# Altium schematic sheet Sheet1.SchDoc
size A4; SheetNumber: 1; SheetTotal: 1
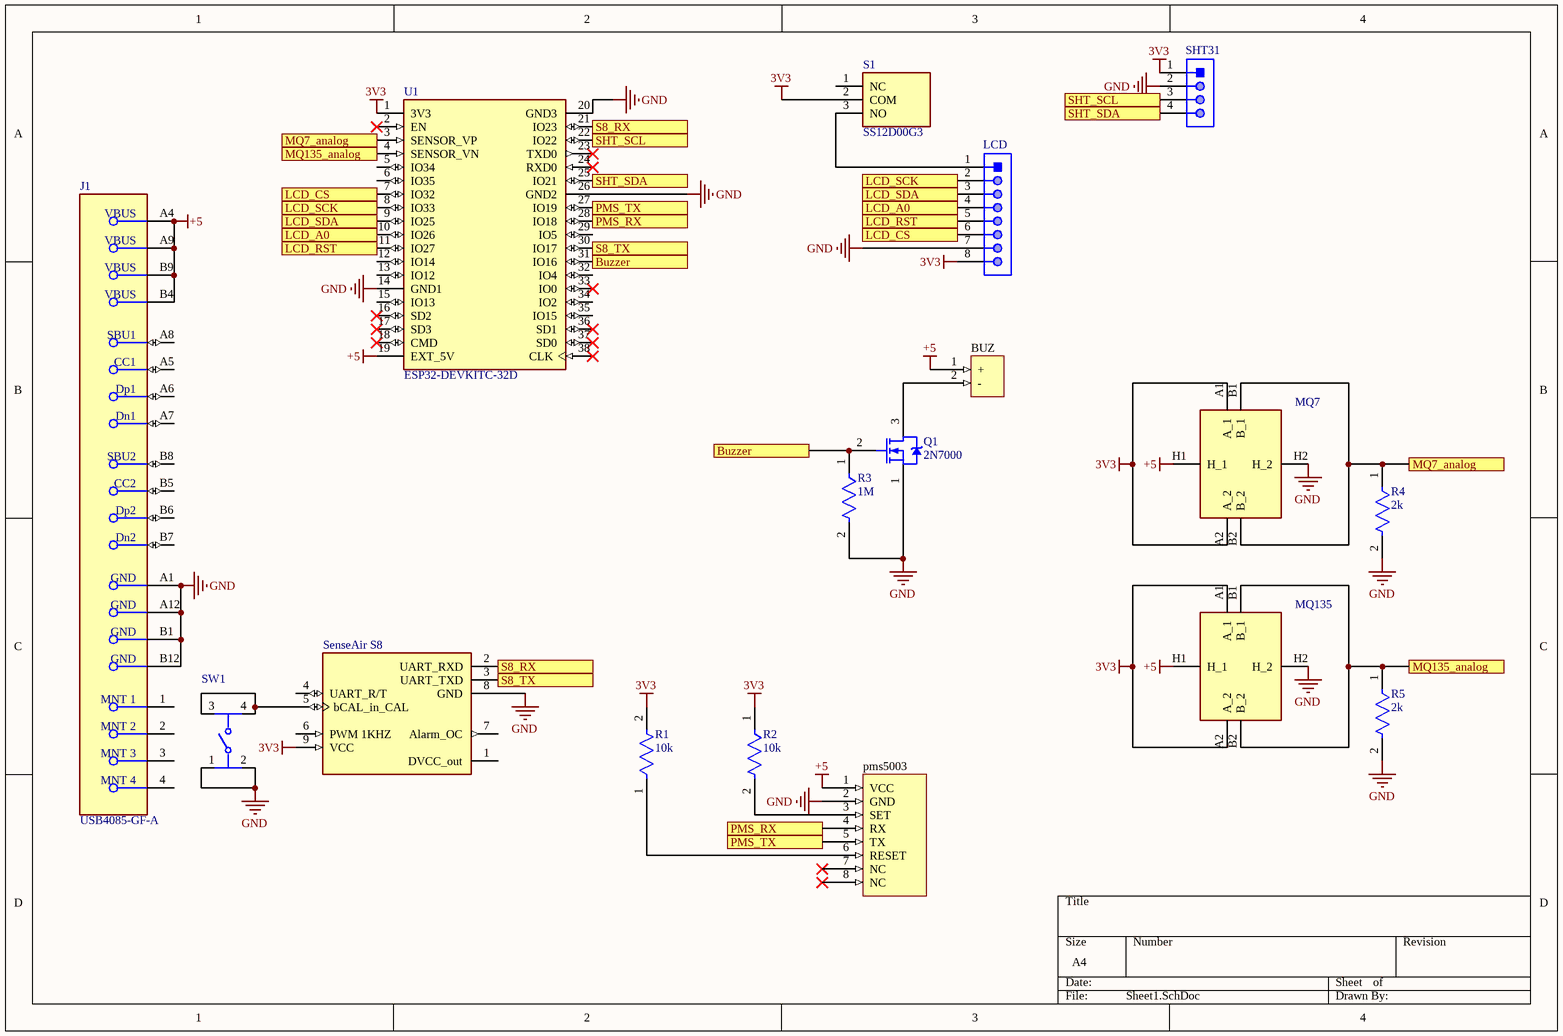
[diagram p0: Sheet1.SchDoc]

## Parts
BUZ  buzzer  [buzzer]  (value not drawn)
J1  USB4085-GF-A  [FP-USB4085-GF-A-MFG]
LCD  61300811121  [61300811121]  (value not drawn)
MQ7  POLOLU-1482  [POLOLU1482]  (value not drawn)
MQ135  POLOLU-1482  [POLOLU1482]  (value not drawn)
pms5003  pms5003  [pms5003]  (value not drawn)
Q1  2N7000  [ONSC-TO-92-3-29-11]
R1  10k  [FP-RC1206-MFG]
R2  10k  [FP-RC1206-MFG]
R3  1M  [FP-RC1206-MFG]
R4  2k  [FP-RC1206-MFG]
R5  2k  [FP-RC1206-MFG]
S1  SS12D00G3  [SS12D00G3]
SenseAir_S8  006-0-0002  [XDCR_006-0-0002]  (value not drawn)
SHT31  61300411121  [61300411121]  (value not drawn)
SW1  3-1825910-1  [FP-3-1825910-1-MFG]  (value not drawn)
U1  ESP32-DEVKITC-32D  [MODULE_ESP32-DEVKITC-32D]

## Ports
Buzzer, LCD_A0, LCD_CS, LCD_RST, LCD_SCK, LCD_SDA, MQ7_analog, MQ135_analog, PMS_RX, PMS_TX, S8_RX, S8_TX, SHT_SCL, SHT_SDA

## Nets
3V3: LCD.8 MQ7.A1(A_1) MQ7.A2(A_2) MQ135.A1(A_1) MQ135.A2(A_2) R1.2 R2.1 S1.2(COM) SenseAir_S8.9(VCC) SHT31.1 U1.1(3V3)
+5: BUZ.1(+) J1.A4(VBUS) J1.A9(VBUS) J1.B4(VBUS) J1.B9(VBUS) MQ7.H1(H_1) MQ135.H1(H_1) pms5003.1(VCC) U1.19(EXT_5V)
GND: J1.A1(GND) J1.A12(GND) J1.B1(GND) J1.B12(GND) LCD.7 MQ7.H2(H_2) MQ135.H2(H_2) pms5003.2(GND) Q1.1(S) R3.2 R4.2 R5.2 SenseAir_S8.8(GND) SHT31.2 SW1.1 SW1.2 U1.14(GND1) U1.20(GND3) U1.26(GND2)
Buzzer: Q1.2(G) R3.1 U1.31(IO16) ; port Buzzer
LCD_A0: LCD.4 U1.10(IO26) ; port LCD_A0
LCD_CS: LCD.6 U1.7(IO32) ; port LCD_CS
LCD_RST: LCD.5 U1.11(IO27) ; port LCD_RST
LCD_SCK: LCD.2 U1.8(IO33) ; port LCD_SCK
LCD_SDA: LCD.3 U1.9(IO25) ; port LCD_SDA
MQ7_analog: MQ7.B1(B_1) MQ7.B2(B_2) R4.1 U1.3(SENSOR_VP) ; port MQ7_analog
MQ135_analog: MQ135.B1(B_1) MQ135.B2(B_2) R5.1 U1.4(SENSOR_VN) ; port MQ135_analog
PMS_RX: pms5003.4(RX) U1.28(IO18) ; port PMS_RX
PMS_TX: pms5003.5(TX) U1.27(IO19) ; port PMS_TX
S8_RX: SenseAir_S8.2(UART_RXD) U1.21(IO23) ; port S8_RX
S8_TX: SenseAir_S8.3(UART_TXD) U1.30(IO17) ; port S8_TX
SHT_SCL: SHT31.3 U1.22(IO22) ; port SHT_SCL
SHT_SDA: SHT31.4 U1.25(IO21) ; port SHT_SDA
NetBUZ_2: BUZ.2(-) Q1.3(D)
NetLCD_1: LCD.1 S1.3(NO)
Netpms5003_3: pms5003.3(SET) R2.2
Netpms5003_6: pms5003.6(RESET) R1.1
NetSenseAir_S8_5: SenseAir_S8.5(bCAL_in_CAL) SW1.3 SW1.4

Not connected (* = marked no-connect by the designer): J1 1(MNT_1) 2(MNT_2) 3(MNT_3) 4(MNT_4) A5(CC1) A6(Dp1) A7(Dn1) A8(SBU1) B5(CC2) B6(Dp2) B7(Dn2) B8(SBU2); pms5003 7(NC)* 8(NC)*; S1 1(NC); SenseAir_S8 1(DVCC_out) 4(UART_R/T) 6(PWM_1KHZ) 7(Alarm_OC); U1 2(EN)* 5(IO34) 6(IO35) 12(IO14) 13(IO12) 15(IO13) 16(SD2)* 17(SD3)* 18(CMD)* 23(TXD0)* 24(RXD0)* 29(IO5) 32(IO4) 33(IO0)* 34(IO2) 35(IO15) 36(SD1)* 37(SD0)* 38(CLK)*

## Library data of the parts
J1 = CMP-196119-000001-2: CONN RCPT USB2.0 TYPE C 24POS RA; Gender: Receptacle; Number of Positions: 16; USB Standard: USB 2.0; Orientation: Right Angle; Contact Plating: Gold; Contact Material: Copper Alloy
LCD = CMP-1502-01076-1: THT Vertical Pin Header WR-PHD, Pitch 2.54 mm, Single Row, 8 pins; Manufacturer: Wurth Elektronik; Rated Current: 3A; Pin Number: 8; Working Voltage: 250VAC; Gender: Male; Contact Resistance: 20mOhm; Pitch: 2.54mm; Withstanding Voltage: 500VAC; Publisher: WurthElektronik; Operating Temperature: -40to105degC; Orientation: Vertical; Row Number: Single; Part Number: 61300811121; Package Reference: 61300811121; Mounting Technology: THT; Packaging: Bag; Manufacturer URL: http://www.we-online.de; Datasheet URL: https://katalog.we-online.de/em/datasheet/6130xx11121.pdf
MQ7 MQ135 = POLOLU-1482: Integrated Circuit; Manufacturer_Name: Pololu; Datasheet Link: https://www.pololu.com/file/0J313/MQ7.pdf; Height: 14.5mm; Manufacturer_Part_Number: POLOLU-1482
Q1 = CMP-1058-00936-1: Small Signal MOSFET, 200 mA, 60 V, N-Channel, 3-Pin TO-92, Bulk Box; Manufacturer: On Semiconductor; Ciss Typ (pF): 60; VGS(th) Max (V): 3; Crss Typ (pF): 5; Channel Polarity: N Channel; VGS Max (V): 20; Configuration: Single; PD Max (W): 0.35; Coss Typ (pF): 25; ID Max (A): 0.2; PackageVersion: Rev. AM; ComponentLink3URL: http://www.onsemi.cn/pub_link/Collateral/2N6426-D.PDF; ComponentLink2URL: http://www.onsemi.com/pub_link/Collateral/2N7000-D.PDF; DatasheetVersion: Rev. 8; Mounting Technology: Through Hole; V(BR)DSS Min (V): 60; PartNumber: 2N7000; PackageDescription: 3-Pin Transistor Outline, Body 4.825 x 3.685 mm, Pitch 1.27 mm; ComponentLink2Description: Datasheet; ComponentLink1URL: http://www.onsemi.com/; PackageReference: TO-92-3-29-11_AM_SL; Packing: Bulk Box; ComponentLink1Description: Manufacturer URL; Package Type: TO-92; ComponentLink3Description: Package Specification
R1-R5 = CMP-2100-03681-2: RES SMD 0 OHM JUMPER 1/4W 1206; Manufacturer Part Number: RC1206JR-070RL; Manufacturer: YAGEO; Voltage Rating: 200V; Temperature Coefficient: 300ppm/°C; Power Rating: 0.25W; Value: 0Ω; Tolerance: 5%; Temperature Range Low: -55°C; Category: Res; Automotive: No; Ipc Land Pattern Name: RESC310160X55; Device Class L1: Passive Components; Temperature: -55°C to +155°C; ComponentLink2URL: https://www.yageo.com/upload/media/product/productsearch/datasheet/rchip/PYu-RC_Group_51_RoHS_L_10.pdf; Lead Free: Yes; Height: 0.65mm; Footprint Url: https://www.yageo.com/upload/website/yageo_PYu-R_Mount_10_19050818_343.pdf; Package: RC1206; Digikey Description: RES SMD 0 OHM JUMPER 1/4W 1206; Temperature Range High: +155°C; Device Class L3: Chip SMD Resistors; Device Class L2: Resistors; Octopart: https://octopart.com/rc1206jr-070rl-yageo-40025601; Resistance: 0Ω; Series: RC; ComponentLink2Description: Datasheet; Composition: Thick Film; RoHS: TRUE; Mouser Description: Resistor: thick film; SMD; 1206; 0O; 0.25W; ±5%; -55÷155°C
S1 = SS12D00G3: Switch; Manufacturer_Name: Vimex; Datasheet Link: http://vimex.com/switches/techdocs/SS12D00-tech.pdf; Height: 7mm; Manufacturer_Part_Number: SS12D00G3
SenseAir_S8 = 006-0-0002: Carbon Dioxide (CO2) Sensor; MF: Senseair North America Inc.; Availability: Warning; Price: None; Package: None; DigiKey-Purchase-URL: https://snapeda.com/shop?store=DigiKey&id=4817567; Value: *; SnapEDA_Link: https://www.snapeda.com/parts/006-0-0002/Senseair%20North%20America%20Inc./view-part/4817567/?ref=snap; MP: 006-0-0002
SHT31 = CMP-1502-01064-1: THT Vertical Pin Header WR-PHD, Pitch 2.54 mm, Single Row, 4 pins; Manufacturer: Wurth Elektronik; Withstanding Voltage: 500VAC; Rated Current: 3A; Working Voltage: 250VAC; Pin Number: 4; Gender: Male; Contact Resistance: 20mOhm; Pitch: 2.54mm; Manufacturer URL: http://www.we-online.de; Operating Temperature: -40to105degC; Packaging: Bag; Mounting Technology: THT; Package Reference: 61300411121; Datasheet URL: https://katalog.we-online.de/em/datasheet/6130xx11121.pdf; Publisher: WurthElektronik; Part Number: 61300411121; Row Number: Single; Orientation: Vertical
SW1 = CMP-03407-000001-1: SWITCH TACTILE SPST-NO 0.05A 24V; Manufacturer: TE Connectivity; Operating Force: 160gf; Contact Current Rating: 50mA; Description: Switch Tactile OFF (ON) SPST Round Button PC Pins 0.05A 24VDC 100000Cycles 1.57N Thru-Hole; Contact Resistance: 100mΩ; Electromechanical Life: 100000Cycles; Device Class L1: Electromechanical; ComponentLink2URL: https://www.te.com/commerce/DocumentDelivery/DDEController?Action=srchrtrv&DocNm=1825910&DocType=Customer+Drawing&DocLang=English; Category: Switch; Device Class L2: Switches; Temperature: -35°C to +85°C; RoHS: TRUE; Mount: Through Hole; Manufacturer Part Number: 3-1825910-1; Automotive: No; Lead Free: Yes; Device Class L3: Tactile Switches; ComponentLink2Description: Datasheet; Temperature Range High: +85°C; Height: 17.3mm; Package: 0; Temperature Range Low: -35°C; Throw Configuration: SPST-NO; Digikey Description: SWITCH TACTILE SPST-NO 0.05A 24V; Octopart: https://octopart.com/3-1825910-1-te+connectivity-46506874
U1 = ESP32-DEVKITC-32D: Eval Board For Esp-Wroom-32; Package: None; Availability: Unavailable; Value: *; MP: ESP32-DEVKITC-32D; Price: None